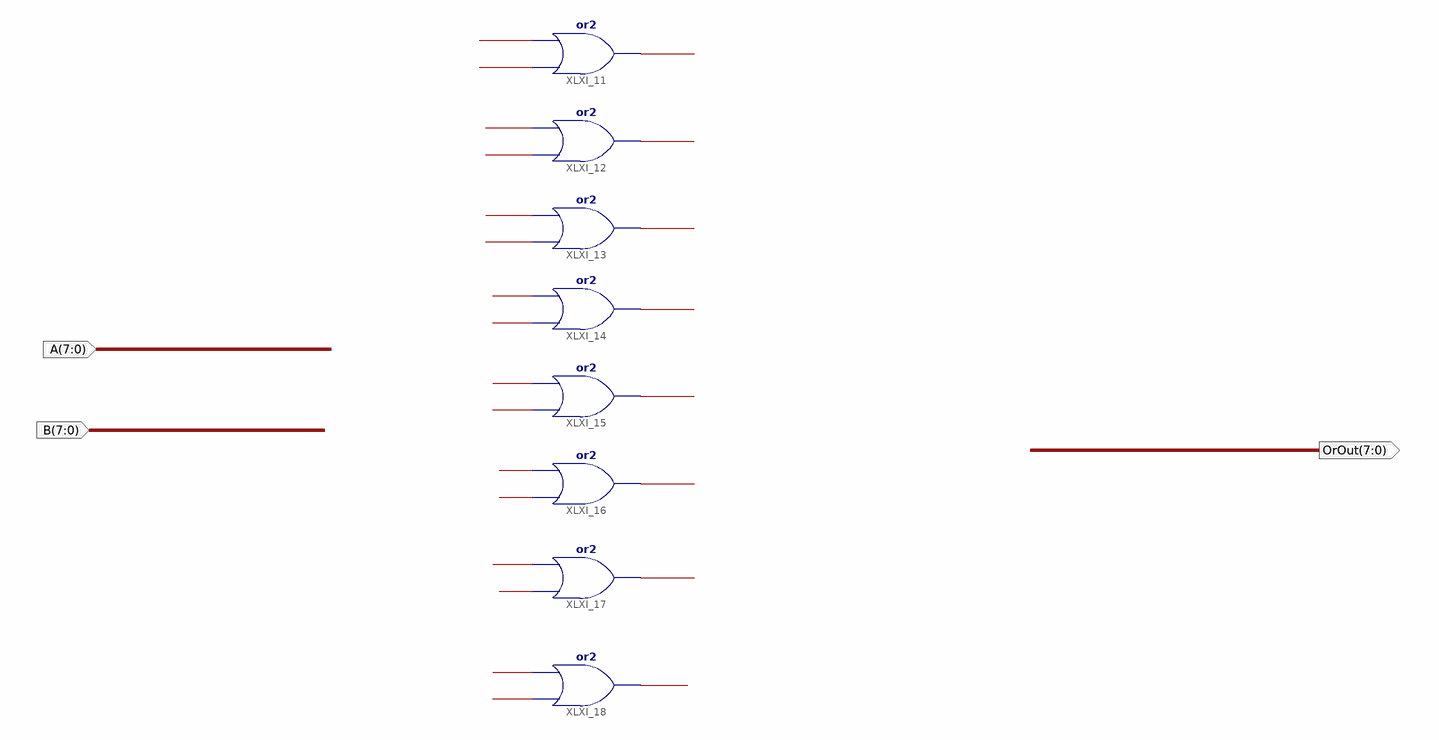
[diagram p0: schematic sheet 1]
// Xilinx ISE schematic EightBitOr.sch (spartan6) as structural Verilog: 8 symbols, 3 ports
module EightBitOr (
  input  [7:0] A,
  input  [7:0] B,
  output [7:0] OrOut
);

  or XLXI_11 (OrOut[0], B[0], A[0]);
  or XLXI_12 (OrOut[1], B[1], A[1]);
  or XLXI_13 (OrOut[2], B[2], A[2]);
  or XLXI_14 (OrOut[3], B[3], A[3]);
  or XLXI_15 (OrOut[4], B[4], A[4]);
  or XLXI_16 (OrOut[5], B[5], A[5]);
  or XLXI_17 (OrOut[6], B[6], A[6]);
  or XLXI_18 (OrOut[7], B[7], A[7]);
endmodule
